# EAGLE design otb-826 breakout v0.1 (EAGLE 7.4.0)
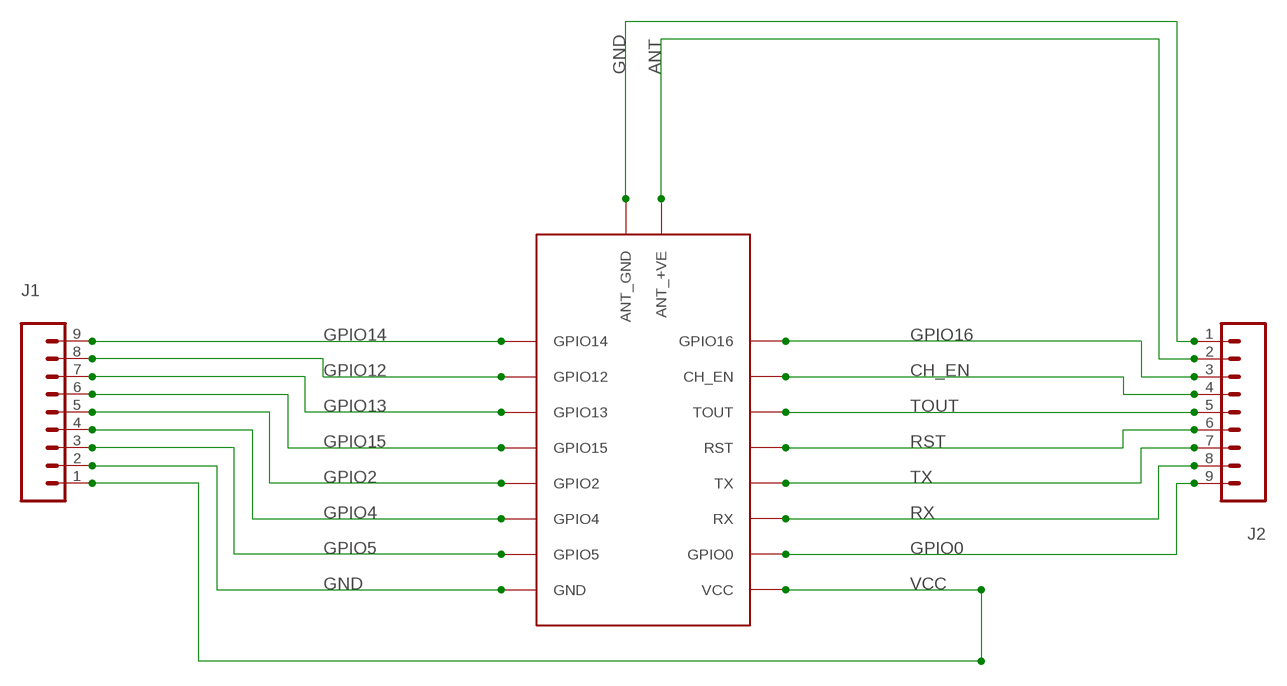
[diagram p0: schematic, sheet 1]

## Parts
J1  M09  [1X09]
J2  M09  [1X09]
OTB-8266  OTB-8266-V0.1  [OTB-8266-V0.1]

## Nets
ANT: J2.2 OTB-8266.ANT_+VE
CH_EN: J2.4 OTB-8266.CH_EN
GND: J1.2 J2.1 OTB-8266.ANT_GND OTB-8266.GND
GPIO0: J2.9 OTB-8266.GPIO0
GPIO2: J1.5 OTB-8266.GPIO2
GPIO4: J1.4 OTB-8266.GPIO4
GPIO5: J1.3 OTB-8266.GPIO5
GPIO12: J1.8 OTB-8266.GPIO12
GPIO13: J1.7 OTB-8266.GPIO13
GPIO14: J1.9 OTB-8266.GPIO14
GPIO15: J1.6 OTB-8266.GPIO15
GPIO16: J2.3 OTB-8266.GPIO16
RST: J2.6 OTB-8266.RST
RX: J2.8 OTB-8266.RX
TOUT: J2.5 OTB-8266.TOUT
TX: J2.7 OTB-8266.TX
VCC: J1.1 OTB-8266.VCC

## Library data of the parts
J1 J2 = SparkFun-Connectors:M09: Header 9 Standard 9-pin 0.1" header. Use with straight break away headers (SKU : PRT-00116), right angle break away headers (PRT-00553), swiss pins (PRT-00743), machine pins (PRT-00117), and female headers (PRT-00115).
OTB-8266 = Piers's library:OTB-8266-V0.1

## Board
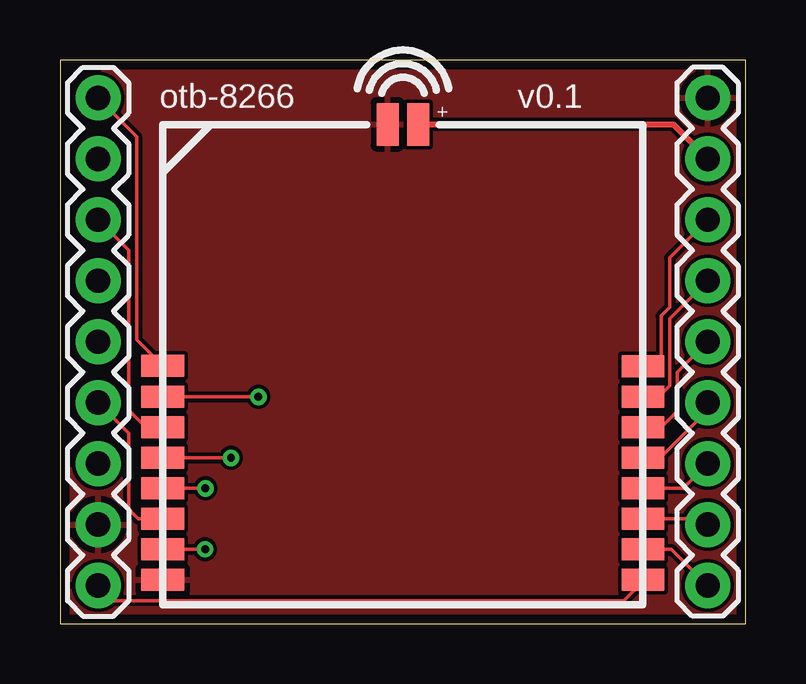
[diagram p1: board, top side]
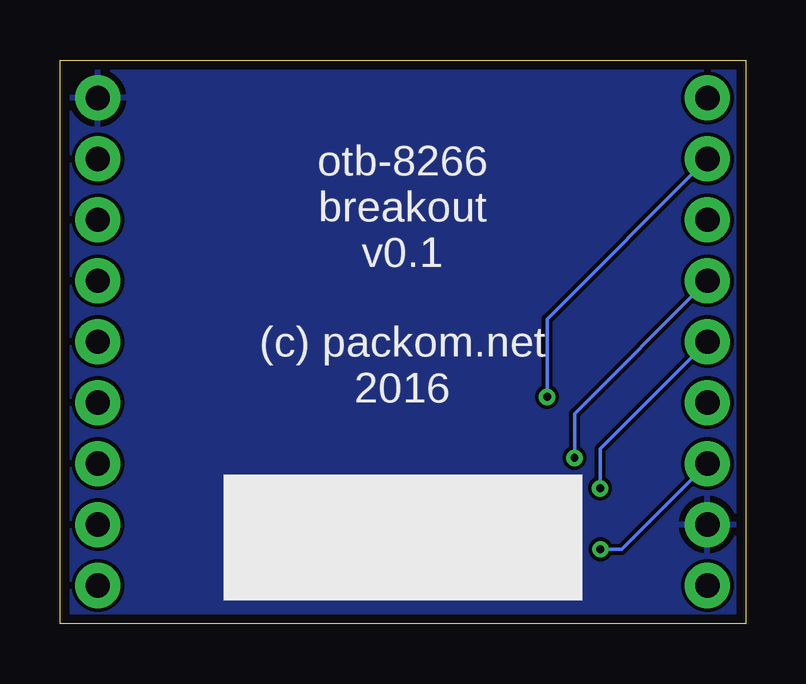
[diagram p2: board, bottom side, seen from below]

Size 28.56 x 23.48 mm. Coordinates in mm from the lower left corner, seen from the top.
Outline: 0,0 28.56,0 28.56,23.48 0,23.48 0,0
Copper layers (1*16): Top 0.0356mm / dielectric 1.5011mm / Bottom 0.0356mm
Design rules "LaenPCBOrder": minimum track width 6mil, minimum drill 13mil, track to track 6mil, track to pad 6mil, pad to pad 6mil, via to via 6mil, smd to smd 6mil, copper to edge 15mil, drill to drill 6mil, minimum pad ring 7mil, minimum via ring 7mil, stop-mask expansion 3mil, vias tented up to drill 0mil, thermal gap 10mil

### Footprints (pad centres in the part's own frame; a part is rotated, then mirrored left to right if it is on the bottom)
1X09 = drill 1.016 pad 1.88: 1 0,0; 2 2.54,0; 3 5.08,0; 4 7.62,0; 5 10.16,0; 6 12.7,0; 7 15.24,0; 8 17.78,0; 9 20.32,0
OTB-8266-V0.1 = smd 0.914 x 1.778: ANT_+VE 0.635,10.008; ANT_GND -0.635,10.008 | smd 1.778 x 0.914: CH_EN 10.008,-1.346; GND -10.008,-8.966; GPIO0 10.008,-7.696; GPIO2 -10.008,-5.156; GPIO4 -10.008,-6.426; GPIO5 -10.008,-7.696; GPIO12 -10.008,-1.346; GPIO13 -10.008,-2.616; GPIO14 -10.008,-0.051; GPIO15 -10.008,-3.886; GPIO16 10.008,-0.076; RST 10.008,-3.886; RX 10.008,-6.426; TOUT 10.008,-2.616; TX 10.008,-5.156; VCC 10.008,-8.966

### Placement (x,y rotation side)
J1  1.59,1.59 90 top
J2  26.99,21.91 270 top
OTB-8266  14.29,10.79 0 top

### Tracks (layer width: path | path; a pad name or v marks a point on that pad's centre or on a via)
ANT
  Top 0.254: OTB-8266.ANT_+VE 25.55,20.8 J2.2
CH_EN
  Top 0.152: OTB-8266.CH_EN 24.96,9.45 25.41,9.91 25.41,12.71 J2.4
GND
  pour Bottom: 0,23.5 28.57,23.5 28.57,0 0,0
  pour Top: 0,23.5 28.57,23.5 28.57,0 0,0
GPIO0
  Top 0.152: OTB-8266.GPIO0 25.48,3.1 J2.9
GPIO2  (via drill 0.33)
  Top 0.152: OTB-8266.GPIO2 v6.06,5.64
  Bottom 0.152: v6.06,5.64 6.06,7.28 J1.5
GPIO4
  Top 0.152: OTB-8266.GPIO4 3.25,4.37 2.86,4.76 2.86,7.94 J1.4
GPIO5  (via drill 0.33)
  Top 0.152: OTB-8266.GPIO5 v6.04,3.1
  Bottom 0.152: v6.04,3.1 5.16,3.1 J1.3
GPIO12  (via drill 0.33)
  Top 0.152: OTB-8266.GPIO12 v8.27,9.45
  Bottom 0.152: v8.27,9.45 8.27,12.69 J1.8
GPIO13
  Top 0.152: OTB-8266.GPIO13 3.57,8.18 2.86,8.89 2.86,15.56 J1.7
GPIO14
  Top 0.152: J1.9 1.59,21.89 3.19,20.3 3.19,11.84 OTB-8266.GPIO14
GPIO15  (via drill 0.33)
  Top 0.152: OTB-8266.GPIO15 v7.12,6.91
  Bottom 0.152: v7.12,6.91 7.12,8.75 J1.6
GPIO16
  Top 0.152: J2.3 25.4,15.24 25.4,13.18 25.04,12.83 25.04,10.74 25.02,10.72 OTB-8266.GPIO16
RST
  Top 0.152: OTB-8266.RST 25.01,6.91 26.99,8.89 J2.6
RX
  Top 0.152: OTB-8266.RX 26.75,4.37 J2.8
TOUT
  Top 0.152: OTB-8266.TOUT 25.06,8.18 25.72,8.84 25.72,10.48 J2.5
TX
  Top 0.152: OTB-8266.TX 25.96,5.64 J2.7
VCC
  Top 0.152: OTB-8266.VCC 24.3,1.75 23.5,0.95 2.22,0.95 J1.1

### Text on the board
tNames: otb-8266 | v0.1
bNames: otb-8266 / breakout / v0.1 | (c) packom.net / 2016